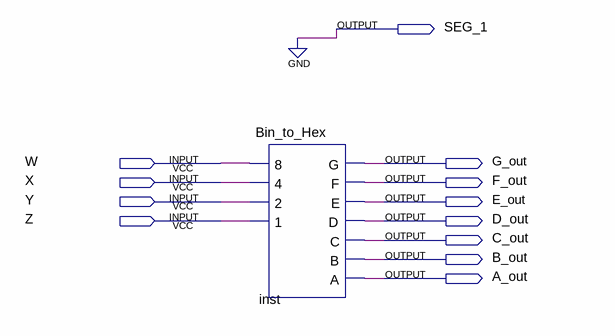
[diagram p0: schematic sheet]
// Quartus schematic lab1.bdf as structural Verilog: 1 symbols, 12 pins
module lab1 (
  input  W,
  input  X,
  input  Y,
  input  Z,
  output SEG_1,
  output G_out,
  output F_out,
  output E_out,
  output D_out,
  output C_out,
  output B_out,
  output A_out
);

  Bin_to_Hex inst (
    .\8 (W), .\4 (X), .\2 (Y), .\1 (Z), .G(G_out), .F(F_out), .E(E_out), .D(D_out), .C(C_out), .B(B_out),
    .A(A_out));

  assign SEG_1 = 1'b0;
endmodule
